# EAGLE design round (EAGLE 7.0.0)
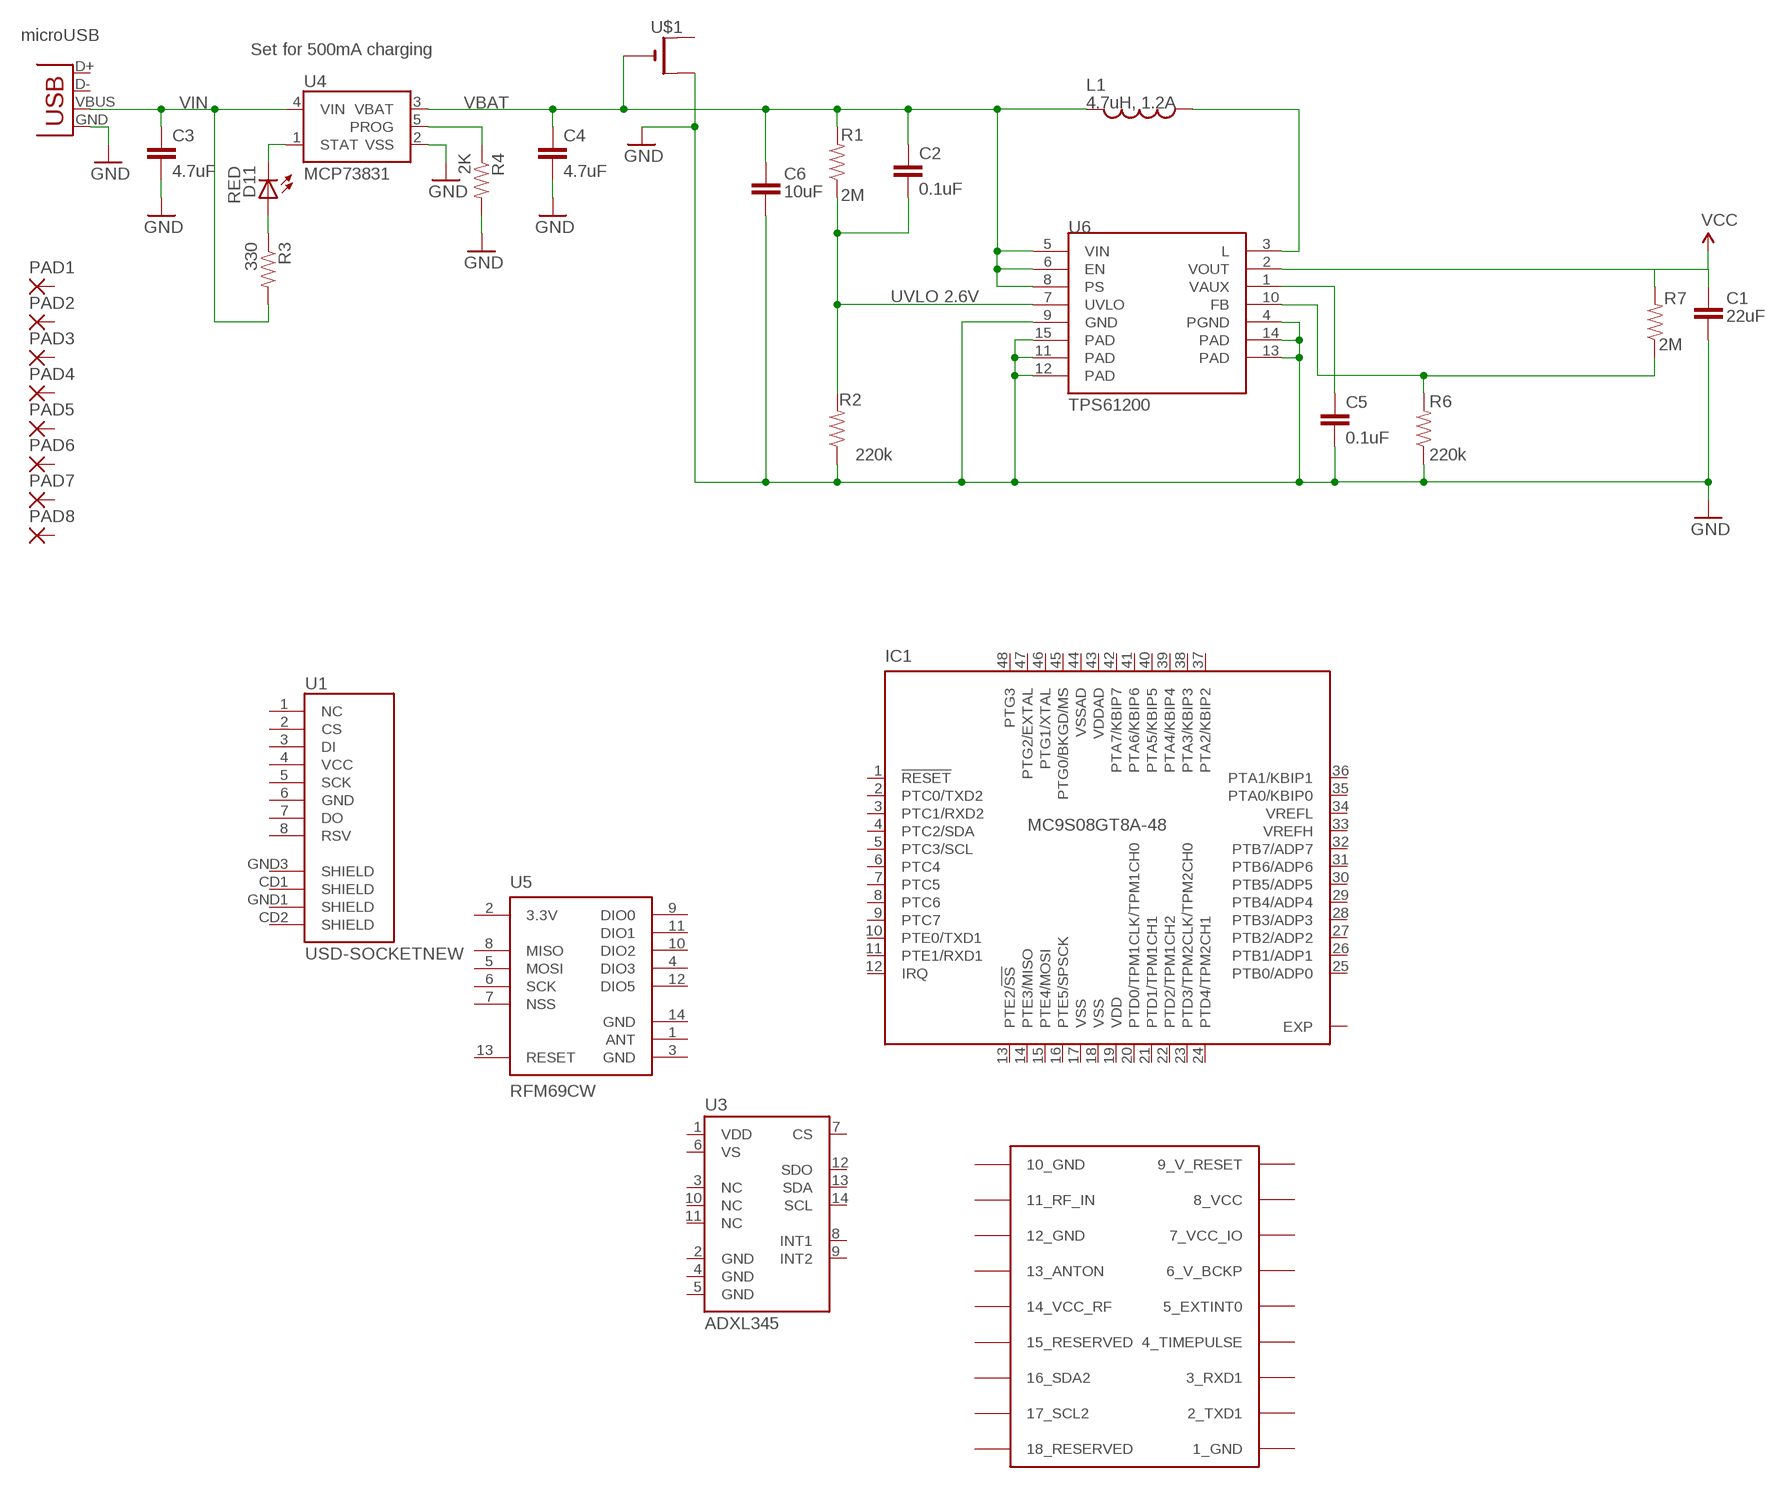
[diagram p0: schematic, sheet 1]

## Parts
C1  22uF  CAP0805  [0805]
C2  0.1uF  CAP0603-CAP  [0603-CAP]
C3  4.7uF  CAP0402-CAP  [0402-CAP]
C4  4.7uF  CAP0402-CAP  [0402-CAP]
C5  0.1uF  CAP0603-CAP  [0603-CAP]
C6  10uF  CAP1206  [1206]
D11  RED  LED0603  [LED-0603]
IC1  MC9S08GT8A-48  [QFN48]
L1  4.7uH, 1.2A  INDUCTOR.  [CDRH2D09]
PAD1  2,15/1,0  [2,15/1,0]
PAD2  2,15/1,0  [2,15/1,0]
PAD3  2,15/1,0  [2,15/1,0]
PAD4  2,15/1,0  [2,15/1,0]
PAD5  2,15/1,0  [2,15/1,0]
PAD6  2,15/1,0  [2,15/1,0]
PAD7  2,15/1,0  [2,15/1,0]
PAD8  2,15/1,0  [2,15/1,0]
R1  2M  RESISTOR0603-RES  [0603-RES]
R2  220k  RESISTOR0603-RES  [0603-RES]
R3  330  RESISTOR0402-RES  [0402-RES]
R4  2K  RESISTOR0402-RES  [0402-RES]
R6  220k  RESISTOR0603-RES  [0603-RES]
R7  2M  RESISTOR0603-RES  [0603-RES]
U1  USD-SOCKETNEW  [MICRO-SD-SOCKET-PP]
U3  ADXL345  [LGA14]
U4  MCP73831  [SOT23-5]
U5  RFM69CW  [RFM69CW-XXXS2]
U6  TPS61200  [QFN-10_PAD]
U$1  CR1220SMT  [CR1220-SMD]
U$2  UBLOX_MAX  [UBLOX_MAX]
X1  Micro USB  USB-MICROB  [USB-MICROB]

## Nets
FB: R6.2 R7.1 U6.10(FB)
GND: C1.2 C3.2 C4.2 C5.2 C6.2 R2.1 R4.2 R6.1 U4.2(VSS) U6.4(PGND) U6.9(GND) U6.11(PAD) U6.12(PAD) U6.13(PAD) U6.14(PAD) U6.15(PAD) U$1.+$2(+1) X1.GND
N$1: C5.1 U6.1(VAUX)
N$2: L1.P$1 U6.3(L)
N$3: D11.A R3.1
PROG: R4.1 U4.5(PROG)
STAT: D11.C U4.1(STAT)
UVLO: C2.2 R1.1 R2.2 U6.7(UVLO)
VBAT: C2.1 C4.1 C6.1 L1.P$2 R1.2 U4.3(VBAT) U6.5(VIN) U6.6(EN) U6.8(PS) U$1.-
VCC: C1.1 R7.2 U6.2(VOUT)
VIN: C3.1 R3.2 U4.4(VIN) X1.VBUS
Unconnected: IC1.1(!RESET) IC1.2(PTC0/TXD2) IC1.3(PTC1/RXD2) IC1.4(PTC2/SDA) IC1.5(PTC3/SCL) IC1.6(PTC4) IC1.7(PTC5) IC1.8(PTC6) IC1.9(PTC7) IC1.10(PTE0/TXD1) IC1.11(PTE1/RXD1) IC1.12(IRQ) IC1.13(PTE2/!SS) IC1.14(PTE3/MISO) IC1.15(PTE4/MOSI) IC1.16(PTE5/SPSCK) IC1.20(PTD0/TPM1CLK/TPM1CH0) IC1.21(PTD1/TPM1CH1) IC1.22(PTD2/TPM1CH2) IC1.23(PTD3/TPM2CLK/TPM2CH0) IC1.24(PTD4/TPM2CH1) IC1.25(PTB0/ADP0) IC1.26(PTB1/ADP1) IC1.27(PTB2/ADP2) IC1.28(PTB3/ADP3) IC1.29(PTB4/ADP4) IC1.30(PTB5/ADP5) IC1.31(PTB6/ADP6) IC1.32(PTB7/ADP7) IC1.33(VREFH) IC1.34(VREFL) IC1.35(PTA0/KBIP0) IC1.36(PTA1/KBIP1) IC1.37(PTA2/KBIP2) IC1.38(PTA3/KBIP3) IC1.39(PTA4/KBIP4) IC1.40(PTA5/KBIP5) IC1.41(PTA6/KBIP6) IC1.42(PTA7/KBIP7) IC1.45(PTG0/BKGD/MS) IC1.46(PTG1/XTAL) IC1.47(PTG2/EXTAL) IC1.48(PTG3) IC1.EXP PAD1.1(P) PAD2.1(P) PAD3.1(P) PAD4.1(P) PAD5.1(P) PAD6.1(P) PAD7.1(P) PAD8.1(P) U1.1(NC) U1.2(CS) U1.3(DI) U1.4(VCC) U1.5(SCK) U1.6(GND) U1.7(DO) U1.8(RSV) U1.CD1(SHIELD) U1.CD2(SHIELD) U1.GND1(SHIELD) U1.GND3(SHIELD) U3.1(VDD) U3.2(GND) U3.3(NC) U3.4(GND) U3.5(GND) U3.6(VS) U3.7(CS) U3.8(INT1) U3.9(INT2) U3.10(NC) U3.11(NC) U3.12(SDO) U3.13(SDA) U3.14(SCL) U5.1(ANT) U5.4(DIO3) U5.5(MOSI) U5.6(SCK) U5.7(NSS) U5.8(MISO) U5.9(DIO0) U5.10(DIO2) U5.11(DIO1) U5.12(DIO5) U5.13(RESET) U$1.+$1(+) U$2.2_TXD1 U$2.3_RXD1 U$2.4_TIMEPULSE U$2.5_EXTINT0 U$2.6_V_BCKP U$2.11_RF_IN U$2.13_ANTON U$2.14_VCC_RF U$2.15_RESERVED U$2.16_SDA2 U$2.17_SCL2 U$2.18_RESERVED X1.D+ X1.D-

## Notes on the sheet
- microUSB
- Set for 500mA charging
- UVLO 2.6V

## Power pins joined to a net without a drawn wire
1_GND: U$2.1_GND
3.3V: U5.2(3.3V)
7_VCC_IO: U$2.7_VCC_IO
8_VCC: U$2.8_VCC
9_V_RESET: U$2.9_V_RESET
10_GND: U$2.10_GND
12_GND: U$2.12_GND
GND: U5.3(GND) U5.14(GND)
VDD: IC1.19(VDD)
VDDAD: IC1.43(VDDAD)
VSS: IC1.17(VSS) IC1.18(VSS)
VSSAD: IC1.44(VSSAD)

## Library data of the parts
C1 C6 = CH_passive:CAP: Capacitor Standard 0603 ceramic capacitor, and 0.1" leaded capacitor.
C2-C5 = SparkFun:CAP: Capacitor Standard 0603 ceramic capacitor, and 0.1" leaded capacitor.
D11 = SparkFun:LED: LEDs Standard schematic elements and footprints for 5mm, 3mm, 1206, and 0603 sized LEDs. 5mm - Spark Fun Electronics SKU : COM-00529 (and others)
IC1 = freescale:MC9S08GT*A-48: HCS08 Microcontroller Source: http://www.freescale.com/files/microcontrollers/doc/data_sheet/MC9S08GT16A.pdf; MF: MOTOROLA; MPN: MC9S08GT8AMFDE; OC_FARNELL: 1294360; OC_NEWARK: 01M5874
L1 = SparkFun:INDUCTOR: Inductors Basic Inductor/Choke - 0603 and 1206. Footprints are not proven and vary greatly between part numbers.
PAD1-PAD8 = wirepad:2,15/1,0: THROUGH-HOLE PAD
R1-R4 R6 R7 = SparkFun:RESISTOR: Resistor Basic schematic elements and footprints for 0603, 1206, and PTH resistors.
U1 = SparkFun-Connectors:USD-SOCKET: microSD Socket Push-push type uSD socket. Schematic element and footprint production proven. Spark Fun Electronics SKU : PRT-00127. tDoc lines correctly indicate media card edge positions when inserting (unlocked, locked, depressed).
U3 = SparkFun-Sensors:ADXL345: 3-axis SPI/I2C 2/4/8/16g accelerometer
U4 = SparkFun:MCP73831: Microchip's MCP73831 Miniature single cell, fully integrated Li-Ion, Li-polymer charge management controller http://ww1.microchip.com/downloads/en/DeviceDoc/21984a.pdf
U5 = SparkFun-RF:RFM69
U6 = SparkFun:TPS61200: DC to DC Booster
U$1 = adafruit:CR1220: CR1216/CR1220/CR1225 12mm 3V lithium coin cell Great for battery packup. Both SMT and THM holders. Note the THM package has the ground pads on both sides of the PCB so that the masks are the same - this reduces the cost
U$2 = Ava:UBLOX_MAX: UBLOX MAX
X1 = SparkFun:USB: USB Connectors USB-B-PTH is fully proven SKU : PRT-00139 USB-miniB is fully proven SKU : PRT-00587 USB-A-PCB is untested. USB-A-H is throughly reviewed, but untested. Spark Fun Electronics SKU : PRT-00437 USB-B-SMT is throughly reviewed, but untested. Needs silkscreen touching up. USB-A-S has not been used/tested USB-MB-H has not been used/tested

## Board
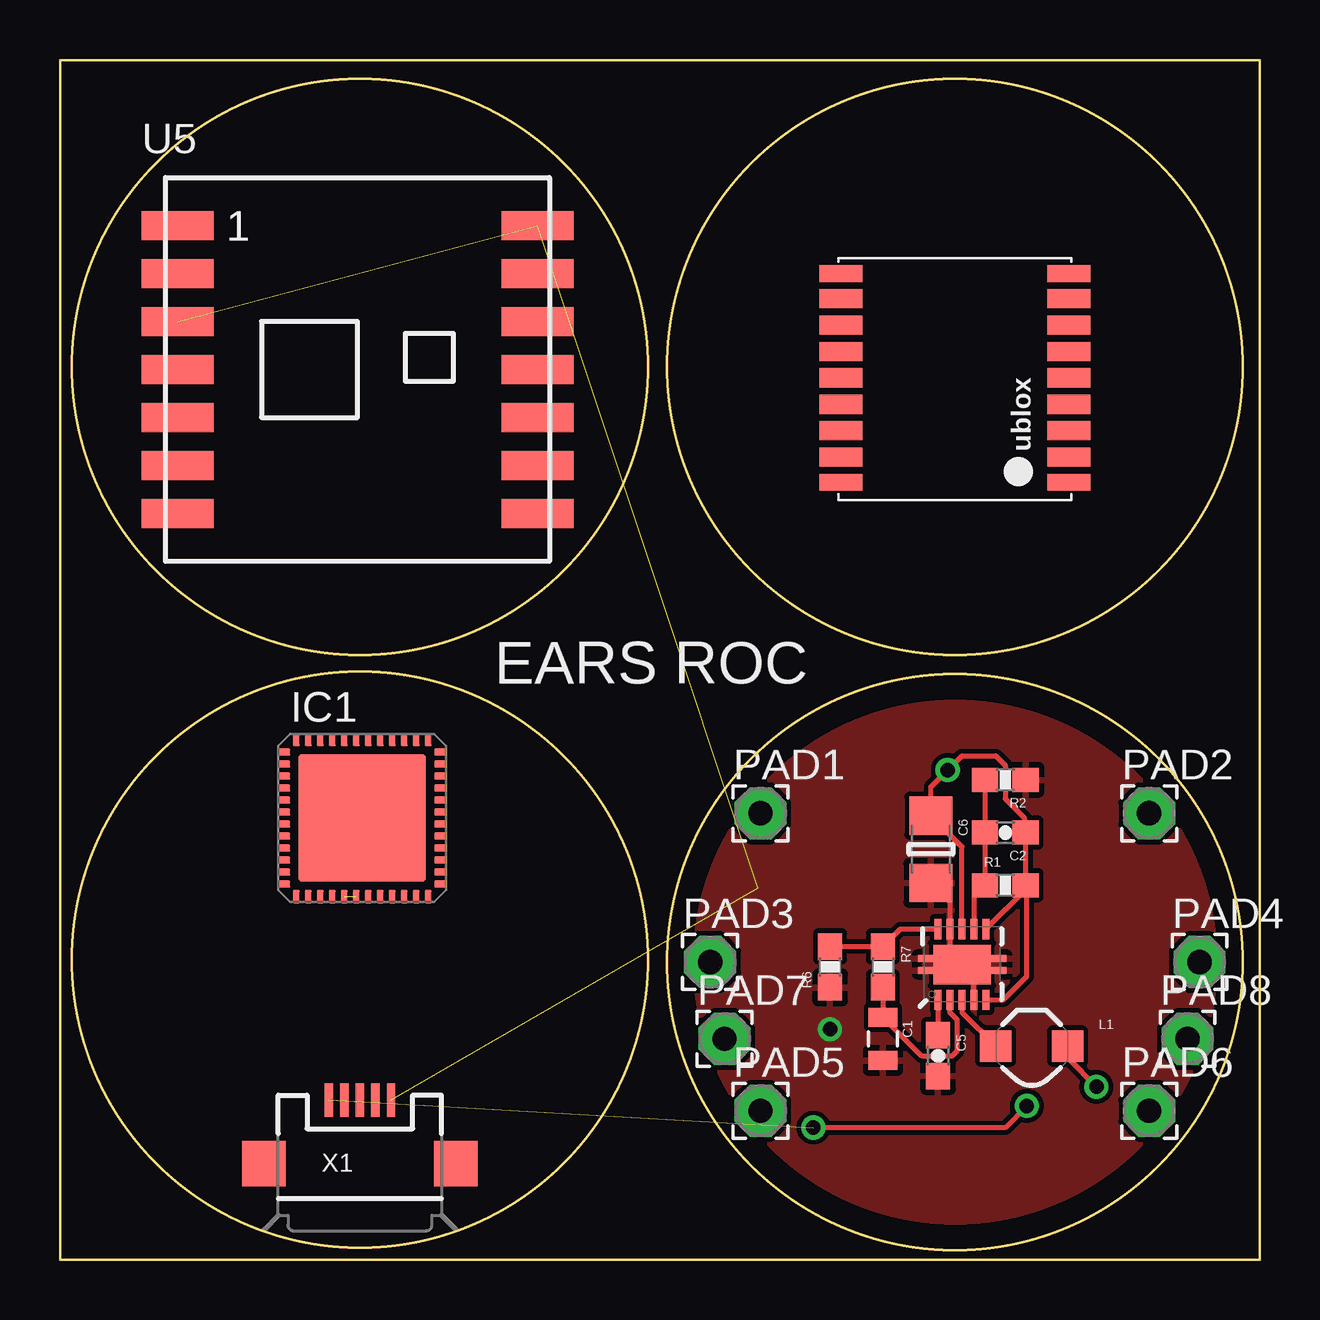
[diagram p1: board, top side]
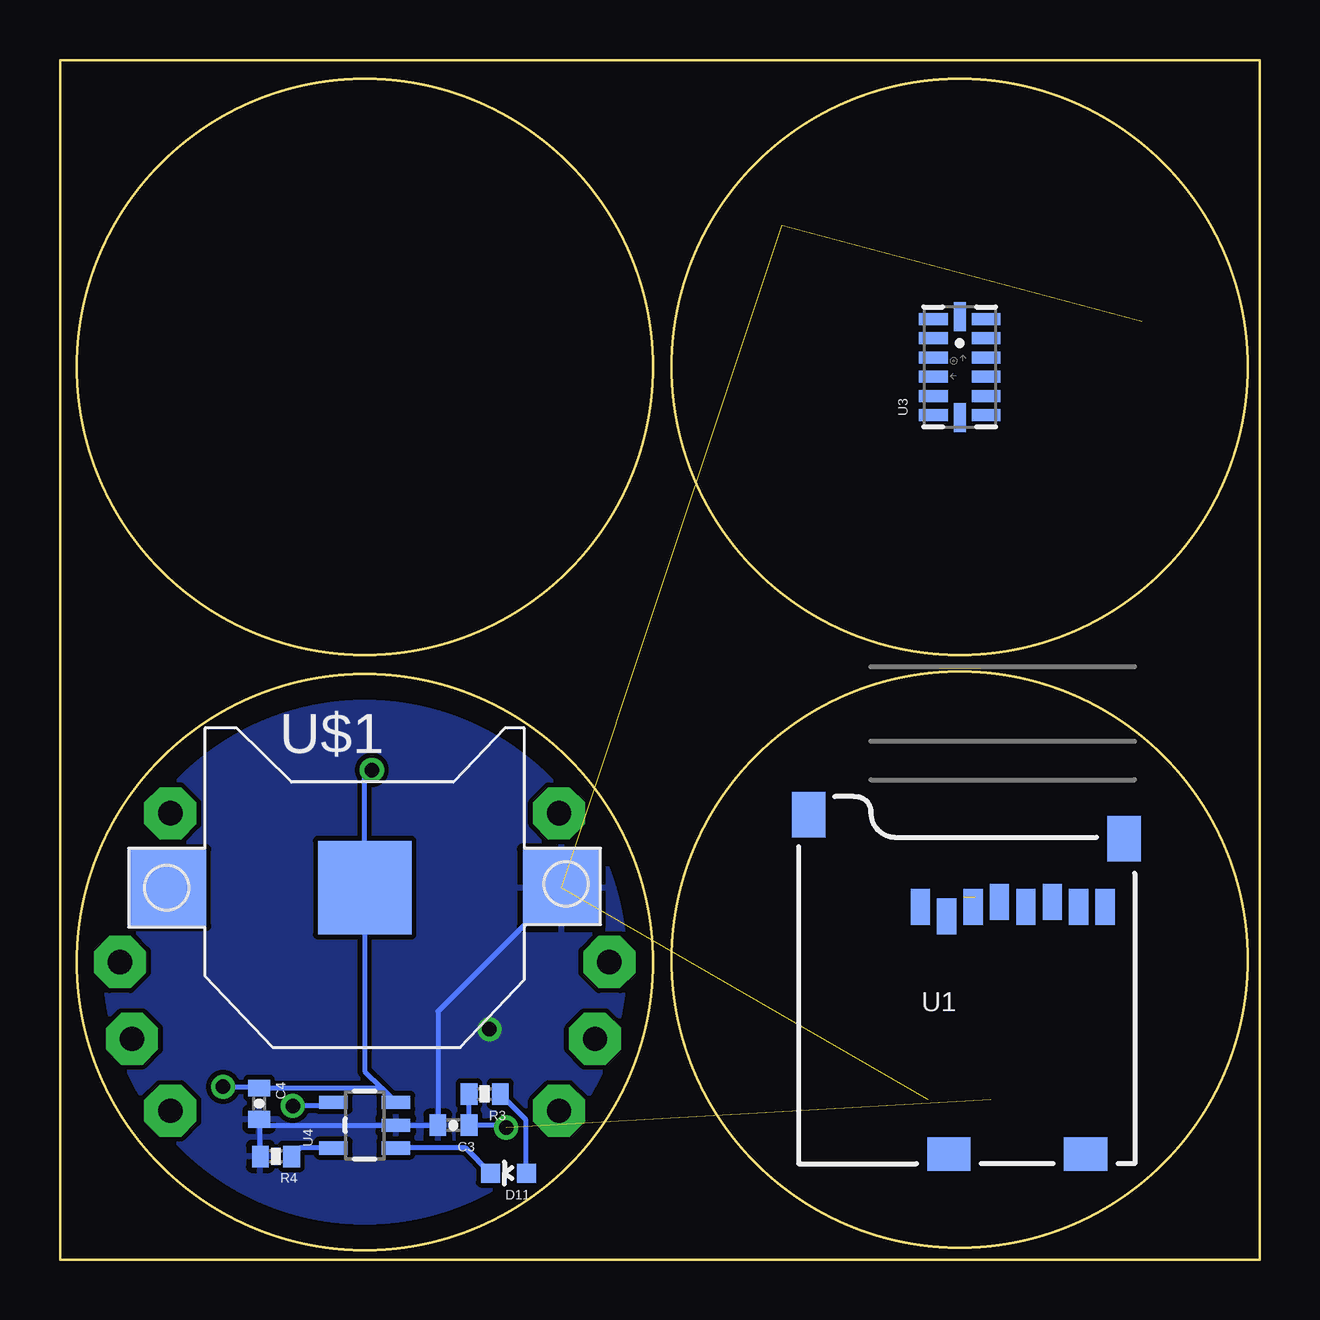
[diagram p2: board, bottom side, seen from below]

Size 50 x 50 mm. Coordinates in mm from the lower left corner, seen from the top.
Outline: 0,0 50,0 50,50 0,50 0,0
Outline: circle at 12.5,12.5 radius 12
Outline: circle at 37.3,12.4 radius 12
Outline: circle at 12.5,37.2 radius 12
Outline: circle at 37.3,37.2 radius 12
Copper layers (1*16): Top 0.035mm / dielectric 1.5mm / Bottom 0.035mm
Design rules "default": minimum track width 10mil, minimum drill 24mil, track to track 8mil, track to pad 8mil, pad to pad 8mil, via to via 8mil, smd to smd 8mil, copper to edge 40mil, drill to drill 8mil, minimum pad ring 10mil, minimum via ring 8mil, stop-mask expansion 4mil, vias tented up to drill 0mil, thermal gap 10mil

### Footprints (pad centres in the part's own frame; a part is rotated, then mirrored left to right if it is on the bottom)
0805 = smd 0.8 x 1.2: 1 -0.9,0; 2 0.9,0
0603-CAP = smd 1.1 x 1: 1 -0.85,0; 2 0.85,0
0402-CAP = smd 0.7 x 0.9: 1 -0.65,0; 2 0.65,0
1206 = smd 1.6 x 1.8: 1 -1.4,0; 2 1.4,0
LED-0603 = smd 0.8 x 0.8: A 0,-0.75; C 0,0.75
QFN48 = smd 0.55 x 0.3: 1 -3.275,2.75; 2 -3.275,2.25; 3 -3.275,1.75; 4 -3.275,1.25; 5 -3.275,0.75; 6 -3.275,0.25; 7 -3.275,-0.25; 8 -3.275,-0.75; 9 -3.275,-1.25; 10 -3.275,-1.75; 11 -3.275,-2.25; 12 -3.275,-2.75; 25 3.275,-2.75; 26 3.275,-2.25; 27 3.275,-1.75; 28 3.275,-1.25; 29 3.275,-0.75; 30 3.275,-0.25; 31 3.275,0.25; 32 3.275,0.75; 33 3.275,1.25; 34 3.275,1.75; 35 3.275,2.25; 36 3.275,2.75 | smd 0.3 x 0.55: 13 -2.75,-3.275; 14 -2.25,-3.275; 15 -1.75,-3.275; 16 -1.25,-3.275; 17 -0.75,-3.275; 18 -0.25,-3.275; 19 0.25,-3.275; 20 0.75,-3.275; 21 1.25,-3.275; 22 1.75,-3.275; 23 2.25,-3.275; 24 2.75,-3.275; 37 2.75,3.275; 38 2.25,3.275; 39 1.75,3.275; 40 1.25,3.275; 41 0.75,3.275; 42 0.25,3.275; 43 -0.25,3.275; 44 -0.75,3.275; 45 -1.25,3.275; 46 -1.75,3.275; 47 -2.25,3.275; 48 -2.75,3.275 | smd 5.309 x 5.309: EXP 0,0
CDRH2D09 = smd 1.3 x 1.3: P$1 -1.5,0; P$2 1.5,0
2,15/1,0 = drill 1.016 pad 2.159 octagon: 1 0,0
0603-RES = smd 1.1 x 1: 1 -0.85,0; 2 0.85,0
0402-RES = smd 0.7 x 0.9: 1 -0.65,0; 2 0.65,0
MICRO-SD-SOCKET-PP = smd 0.8 x 1.5: 1 -8.94,10.7; 2 -7.84,10.3; 3 -6.74,10.7; 4 -5.64,10.9; 5 -4.54,10.7; 6 -3.44,10.9; 7 -2.34,10.7; 8 -1.24,10.7 | smd 1.8 x 1.4: CD1 -2.05,0.4; CD2 -7.75,0.4 | smd 1.4 x 1.9: GND1 -13.6,14.55; GND3 -0.45,13.55
LGA14 = smd 0.5 x 1.2: 1 2,1.1; 2 1.2,1.1; 3 0.4,1.1; 4 -0.4,1.1; 5 -1.2,1.1; 6 -2,1.1; 8 -2,-1.1; 9 -1.2,-1.1; 10 -0.4,-1.1; 11 0.4,-1.1; 12 1.2,-1.1; 13 2,-1.1 | smd 1.2 x 0.5: 7 -2.1,0; 14 2.1,0
SOT23-5 = smd 0.55 x 1.2: 1 -0.95,-1.3; 2 0,-1.3; 3 0.95,-1.3; 4 0.95,1.3; 5 -0.95,1.3
RFM69CW-XXXS2 = smd 3 x 1.2: 1 -7.5,6; 2 -7.5,4; 3 -7.5,2; 4 -7.5,0; 5 -7.5,-2; 6 -7.5,-4; 7 -7.5,-6; 8 7.5,-6; 9 7.5,-4; 10 7.5,-2; 11 7.5,0; 12 7.5,2; 13 7.5,4; 14 7.5,6
QFN-10_PAD = smd 0.297 x 0.85: 1 -1,-1.475; 2 -0.5,-1.475; 3 0,-1.475; 4 0.5,-1.475; 5 1,-1.475; 6 1,1.475; 7 0.5,1.475; 8 0,1.475; 9 -0.5,1.475; 10 -1,1.475 | smd 0.7 x 0.28: 11 -1.5,0.25; 12 -1.5,-0.25; 13 1.5,0.25; 14 1.5,-0.25 | smd 2.4 x 1.65: 15 0,0
CR1220-SMD = smd 3.2 x 3.2: +$1 -8.2,0; +$2 8.2,0 | smd 3.9 x 3.9: - 0,0
UBLOX_MAX = smd 1.8 x 0.7: 1_GND 4.95,-4.4; 9_V_RESET 4.95,4.3; 10_GND -4.55,4.3; 18_RESERVED -4.55,-4.4 | smd 1.8 x 0.8: 2_TXD1 4.95,-3.35; 3_RXD1 4.95,-2.25; 4_TIMEPULSE 4.95,-1.15; 5_EXTINT0 4.95,-0.05; 6_V_BCKP 4.95,1.05; 7_VCC_IO 4.95,2.15; 8_VCC 4.95,3.25; 11_RF_IN -4.55,3.25; 12_GND -4.55,2.15; 13_ANTON -4.55,1.05; 14_VCC_RF -4.55,-0.05; 15_RESERVED -4.55,-1.15; 16_SDA2 -4.55,-2.25; 17_SCL2 -4.55,-3.35
USB-MICROB = smd 0.35 x 1.4: D+ 0,2.65; D- -0.65,2.65; GND 1.3,2.65; ID 0.65,2.65; VBUS -1.3,2.65 | smd 1.8 x 1.9: MT1 -4,0; MT2 4,0

### Placement (x,y rotation side)
C1  34.3,9.2 270 top
C2  39.4,17.8 180 top
C3  33.6,5.6 180 bottom
C4  41.7,6.5 270 bottom
C5  36.6,8.5 270 top
C6  36.3,17.1 270 top
D11  31.3,3.6 90 bottom
IC1  12.6,18.4 0 top
L1  40.5,8.9 0 top
PAD1  29.2,18.6 0 top
PAD2  45.4,18.6 0 top
PAD3  27.1,12.4 0 top
PAD4  47.5,12.4 0 top
PAD5  29.2,6.2 0 top
PAD6  45.4,6.2 0 top
PAD7  27.7,9.2 0 top
PAD8  47,9.2 0 top
R1  39.4,15.6 0 top
R2  39.4,20 180 top
R3  32.3,6.9 180 bottom
R4  41,4.3 180 bottom
R6  32.1,12.2 90 top
R7  34.3,12.2 270 top
U1  5.2,4 0 bottom
U3  12.5,37.2 90 bottom
U4  37.3,5.6 90 bottom
U5  12.4,37.1 0 top
U6  37.6,12.3 0 top
U$1  37.3,15.5 0 bottom
U$2  37.1,36.8 0 top
X1  12.5,4 0 top

### Tracks (layer width: path | path; a pad name or v marks a point on that pad's centre or on a via)
FB
  Top 0.2: R6.2 R7.1 35.02,13.78 U6.10
GND  (via drill 0.6)  (3 unrouted)
  Top 0.2: C6.2 37.1,14.9 U6.9 37.1,12.8 U6.15 | U6.12 37.35,12.05 U6.15 | U6.13 37.85,12.55 U6.15 | U6.4 38.1,11.8 U6.15
  Bottom 0.2: R4.2 41.65,5.8 C4.2 arc-90 41.45,5.6 U4.2 C3.2 34.25,10.35 U$1.+$2
  other vias: 32.1,9.6
  pour Top: 25.5,24.4 49.4,24.4 49.4,0.4 25.4,0.4 25.4,24.4
  pour Bottom: 25.4,24.5 49.4,24.5 49.4,0.4 25.3,0.4 25.3,24.5
N$1
  Top 0.2: U6.1 C5.1
N$2
  Top 0.2: U6.3 37.6,10.3 L1.P$1
N$3
  Bottom 0.2: R3.1 30.6,5.85 30.6,3.65 arc-90 D11.A
PROG
  Bottom 0.2: U4.5 40,4.65 R4.1
STAT
  Bottom 0.2: D11.C 33.1,4.65 U4.1
UVLO
  Top 0.2: U6.7 38.1,15.15 R1.1 C2.2 R2.2
VBAT  (via drill 0.6)
  Top 0.2: U6.6 40.25,15.43 R1.2 | R1.2 C2.1 40.2,17.85 40.2,18.4 39.4,19.2 39.4,20.6 39,21 37.6,21 v37,20.4 36.3,19.7 C6.1 37.6,17.2 U6.8 | U6.5 39.33,10.82 40.3,11.8 40.3,15.55 R1.2 | L1.P$2 42,8.4 v43.2,7.2
  Bottom 0.2: 36.6,7.15 C4.1 41.75,7.2 v43.2,7.2 | 36.6,7.15 U4.3 | 36.6,7.15 37.3,7.85 U$1.- 37.3,20.1 v37,20.4
VCC
  Top 0.2: R7.2 C1.1 35.9,8.5 37.2,8.5 37.4,8.7 37.4,10 37.1,10.3 U6.2
VIN  (via drill 0.6)  (1 unrouted)
  Top 0.2: v40.3,6.4 39.4,5.5 v31.4,5.5
  Bottom 0.2: R3.2 C3.1 31.5,5.6 v31.4,5.5 | U4.4 38.75,6.4 v40.3,6.4
VSS  (1 unrouted)

### Text on the board
tNames: EARS ROC